# EAGLE design cluster (EAGLE 9.4.2)
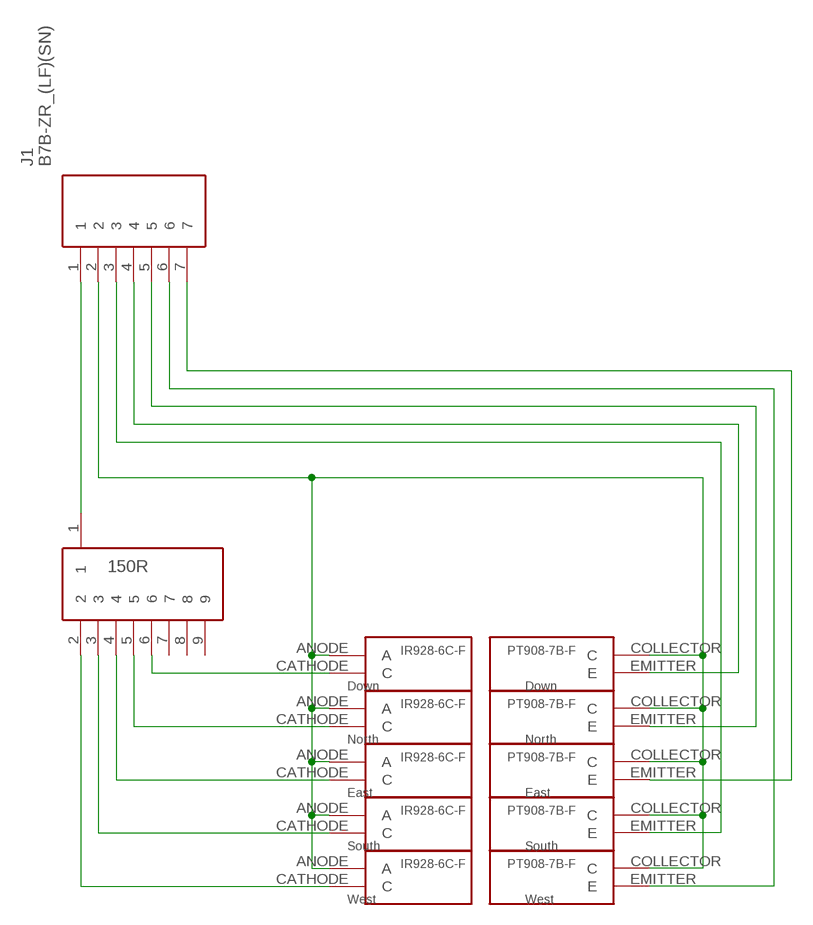
[diagram p0: schematic, sheet 1]

## Parts
150R  150R  9PIN-RESISTOR-NETWORK9PIN-RESISTOR-NETWORK  [9PIN-RESISTOR-NETWORK]
J1  B7B-ZR_(LF)(SN)  [SHDR7W50P0X150_1X7_1200X350X45]
LED1  Down  IR928-6C-F  [IR928-6C-F]
LED2  North  IR928-6C-F  [IR928-6C-F]
LED3  East  IR928-6C-F  [IR928-6C-F]
LED4  South  IR928-6C-F  [IR928-6C-F]
LED5  West  IR928-6C-F  [IR928-6C-F]
PT1  Down  PT908-7B-F  [PT908-7B-F]
PT2  North  PT908-7B-F  [PT908-7B-F]
PT3  East  PT908-7B-F  [PT908-7B-F]
PT4  South  PT908-7B-F  [PT908-7B-F]
PT5  West  PT908-7B-F  [PT908-7B-F]

## Nets
N$1: 150R.1 J1.1
N$2: 150R.2 LED5.CATHODE(C)
N$3: 150R.3 LED4.CATHODE(C)
N$4: 150R.4 LED3.CATHODE(C)
N$5: 150R.5 LED2.CATHODE(C)
N$6: 150R.6 LED1.CATHODE(C)
N$7: J1.2 LED1.ANODE(A) LED2.ANODE(A) LED3.ANODE(A) LED4.ANODE(A) LED5.ANODE(A) PT1.COLLECTOR(C) PT2.COLLECTOR(C) PT3.COLLECTOR(C) PT4.COLLECTOR(C) PT5.COLLECTOR(C)
N$8: J1.3 PT4.EMITTER(E)
N$9: J1.7 PT3.EMITTER(E)
N$10: J1.5 PT2.EMITTER(E)
N$11: J1.4 PT1.EMITTER(E)
N$12: J1.6 PT5.EMITTER(E)
Unconnected: 150R.7 150R.8 150R.9

## Library data of the parts
150R = 9 pin resistor network:9PIN-RESISTOR-NETWORK: 9 pin, standard resistor network; HEIGHT: mm
J1 = SamacSys_Parts:B7B-ZR_(LF)(SN): Connector,Multipole,PCB use,B7B-ZR (LF)( JST ZH Series, 1.5mm Pitch 7 Way 1 Row Straight PCB Header, Solder Termination, 1A Source: Datasheet <http://docs-emea.rs-online.com/webdocs/1147/0900766b81147f94.pdf>; DESCRIPTION: Connector,Multipole,PCB use,B7B-ZR (LF)( JST ZH Series, 1.5mm Pitch 7 Way 1 Row Straight PCB Header, Solder Termination, 1A; HEIGHT: 4.5mm; MANUFACTURER_NAME: JST (JAPAN SOLDERLESS TERMINALS); MANUFACTURER_PART_NUMBER: B7B-ZR (LF)(SN); RS_PART_NUMBER: 7620828; RS_PRICE-STOCK: https://uk.rs-online.com/web/p/products/7620828
LED1-LED5 = IR928-6C-F:IR928-6C-F
PT1-PT5 = PT908-7B-F:PT908-7B-F

## Board
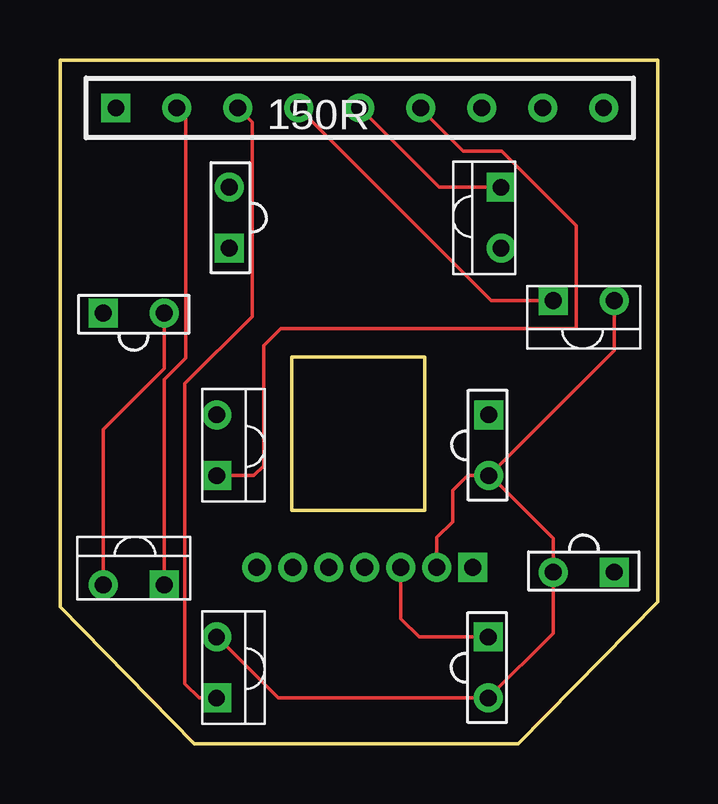
[diagram p1: board, top side]
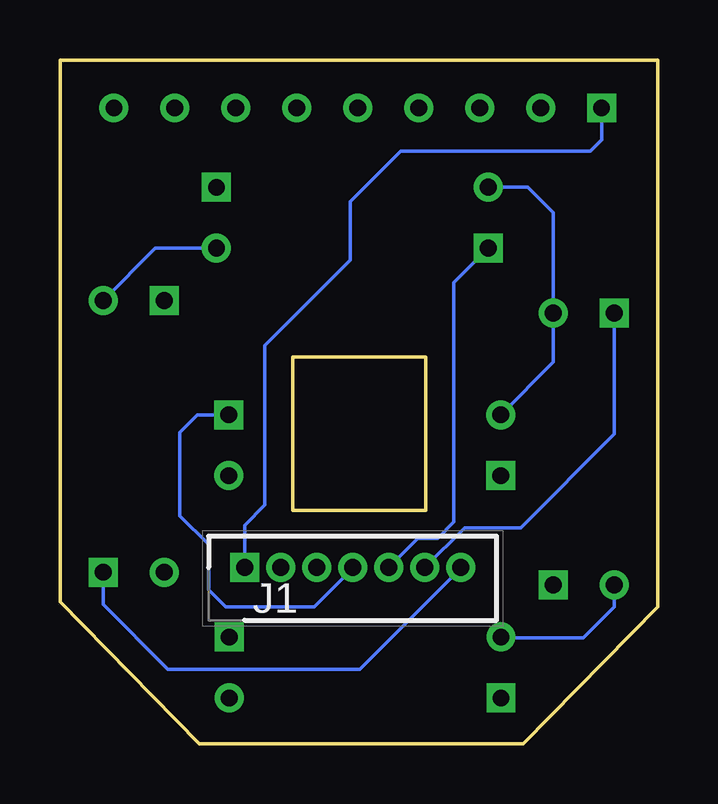
[diagram p2: board, bottom side, seen from below]

Size 24.9 x 28.5 mm. Coordinates in mm from the lower left corner, seen from the top.
Outline: 9.65,16.11 15.19,16.11 15.19,9.73 9.65,9.73 9.65,16.11
Outline: 0,5.7 5.6,0 19.1,0 24.9,5.9 24.9,28.5 0,28.5 0,5.7
Copper layers (1*16): Top 0.035mm / dielectric 1.5mm / Bottom 0.035mm
Design rules "default": minimum track width 6mil, minimum drill 0.35mm, track to track 6mil, track to pad 6mil, pad to pad 6mil, via to via 6mil, smd to smd 6mil, copper to edge 40mil, drill to drill 6mil, minimum pad ring 10mil, minimum via ring 8mil, stop-mask expansion 4mil, vias tented up to drill 0mil, thermal gap 10mil

### Footprints (pad centres in the part's own frame; a part is rotated, then mirrored left to right if it is on the bottom)
9PIN-RESISTOR-NETWORK = drill 0.7 square: 1 0,0 | drill 0.7: 2 2.54,0; 3 5.08,0; 4 7.62,0; 5 10.16,0; 6 12.7,0; 7 15.24,0; 8 17.78,0; 9 20.32,0
SHDR7W50P0X150_1X7_1200X350X45 = drill 0.7 pad 1.1 square: 1 0,0 | drill 0.7 pad 1.1: 2 1.5,0; 3 3,0; 4 4.5,0; 5 6,0; 6 7.5,0; 7 9,0
IR928-6C-F = drill 0.7: ANODE 1.27,0 | drill 0.7 square: CATHODE -1.27,0
PT908-7B-F = drill 0.7: COLLECTOR 1.27,0 | drill 0.7 square: EMITTER -1.27,0

### Placement (x,y rotation side)
150R  2.33,26.5 0 top
J1  17.2,7.34 0 bottom
LED1  6.53,12.44 90 top
LED2  18.38,21.92 270 top
LED3  21.82,18.47 0 top
LED4  6.52,3.17 90 top
LED5  3.07,6.62 180 top
PT1  17.87,12.44 270 top
PT2  7.05,21.92 90 top
PT3  21.82,7.14 180 top
PT4  17.85,3.17 270 top
PT5  3.07,17.95 0 top

### Tracks (layer width: path | path; a pad name or v marks a point on that pad's centre or on a via)
N$1
  Bottom 0.152: J1.1 17.2,9.1 16.36,9.94 16.36,16.59 12.8,20.15 12.8,22.6 10.7,24.7 2.8,24.7 2.33,25.17 150R.1
N$2
  Top 0.152: LED5.CATHODE 4.34,15.17 5.23,16.07 5.23,26.14 150R.2
N$3
  Top 0.152: LED4.CATHODE 5.8,1.9 5.2,2.5 5.2,15 8,17.8 8,25.91 150R.3
N$4
  Top 0.152: LED3.CATHODE 17.98,18.47 150R.4
N$5
  Top 0.152: LED2.CATHODE 15.81,23.19 150R.5
N$6
  Top 0.152: LED1.CATHODE 8.07,11.17 8.48,11.58 8.48,16.59 9.19,17.3 21.5,17.3 21.5,21.6 18.4,24.7 16.8,24.7 15.03,26.47 150R.6
N$7
  Top 0.152: LED3.ANODE 23.09,16.39 17.9,11.2 17.93,11.17 | 17.93,11.17 PT1.COLLECTOR 17.03,11.17 17,11.2 16.36,10.56 16.36,9.24 15.7,8.58 J1.2 | 17.93,11.17 20.55,8.55 PT3.COLLECTOR 20.55,4.6 PT4.COLLECTOR 9.1,1.9 6.56,4.44 LED4.ANODE | LED5.ANODE 1.8,13.1 4.34,15.64 PT5.COLLECTOR
  Bottom 0.152: LED5.ANODE 1.8,5.7 3.1,4.4 6.48,4.4 LED4.ANODE | LED3.ANODE 20.92,20.65 LED2.ANODE | LED1.ANODE 4.34,15.9 PT5.COLLECTOR 4.34,22.14 5.4,23.2 PT2.COLLECTOR
N$8
  Top 0.152: PT4.EMITTER 14.96,4.44 14.2,5.2 J1.3
N$9
  Bottom 0.152: J1.7 8.2,7.3 12.4,3.1 20.4,3.1 23.09,5.79 PT3.EMITTER
N$10
  Bottom 0.152: J1.5 9.98,8.56 9.16,8.56 8.48,9.24 8.48,19.22 PT2.EMITTER
N$11
  Bottom 0.152: J1.4 12.7,7.3 14.3,5.7 18,5.7 18.7,6.4 18.7,8.3 19.9,9.5 19.9,12.98 19.17,13.71 PT1.EMITTER
N$12
  Bottom 0.152: J1.6 8.04,9 5.7,9 1.8,12.9 PT5.EMITTER